# EAGLE design RaspiLabBoard (EAGLE 9.3.2)
RaspiLabBoard
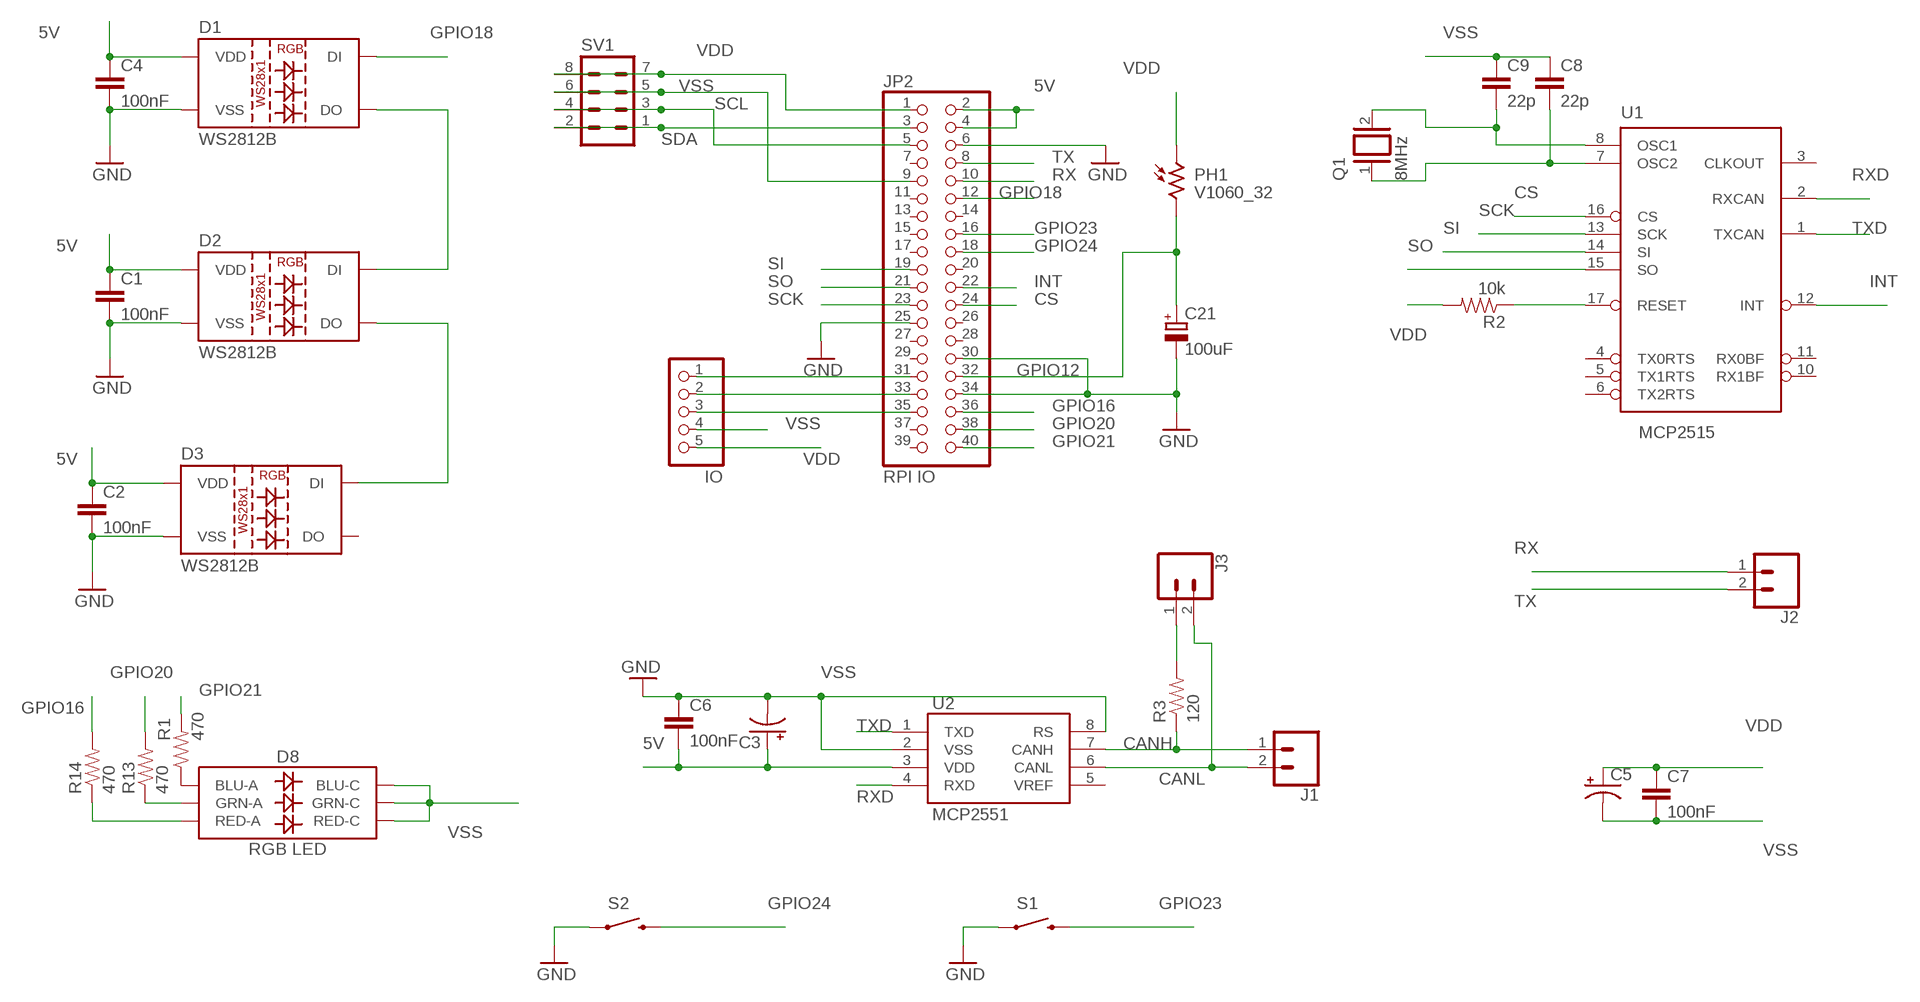
[diagram p0: schematic, sheet 1]

## Parts
C1  100nF  CAP0805  [0805]
C2  100nF  CAP0805  [0805]
C3  CPOL-USE2-5  [E2-5]
C4  100nF  CAP0805  [0805]
C5  CPOL-USE2-5  [E2-5]
C6  100nF  CAP0805  [0805]
C7  100nF  CAP0805  [0805]
C8  22p  CAP0805  [0805]
C9  22p  CAP0805  [0805]
C21  100uF  CPOL-EUE5-10.5  [E5-10,5]
D1  WS2812B  [WS2812B]
D2  WS2812B  [WS2812B]
D3  WS2812B  [WS2812B]
D8  RGB LED  LED-RGBNO_IC  [LED-TRICOLOR-5050]
J1  CONN_02  [1X02]
J2  CONN_02  [1X02]
J3  CONN_02  [1X02]
JP2  RPI IO  PINHD-2X20  [2X20]
JP4  IO  PINHD-1X5  [1X05]
PH1  V1060_32  [TO-5_V10]
Q1  8MHz  XTAL/S  [QS]
R1  470  RESISTOR0805-RES  [0805]
R2  10k  RESISTOR0805-RES  [0805]
R3  120  RESISTOR0805-RES  [0805]
R13  470  RESISTOR0805-RES  [0805]
R14  470  RESISTOR0805-RES  [0805]
S1  RESET  SWITCH-MOMENTARY-2SMD-1101NE  [TACTILE-SWITCH-1101NE]
S2  RESET  SWITCH-MOMENTARY-2SMD-1101NE  [TACTILE-SWITCH-1101NE]
SV1  MA04-2  [MA04-2]
U1  MCP2515  MCP2515(MCP2510)SO  [SO18W]
U2  MCP2551  [SO08]

## Nets
5V: C1.1 C2.1 C3.+ C4.1 C6.2 D1.1(VDD) D2.1(VDD) D3.1(VDD) JP2.2 JP2.4 U2.3(VDD)
CANH: J1.1 R3.1 U2.7(CANH)
CANL: J1.2 J3.2 U2.6(CANL)
CS: JP2.24 U1.16(CS)
GPIO6: JP2.31 JP4.1
GPIO12: C21.+ JP2.32 PH1.2
GPIO13: JP2.33 JP4.2
GPIO16: JP2.36 R14.2
GPIO18: D1.4(DI) JP2.12
GPIO19: JP2.35 JP4.3
GPIO20: JP2.38 R13.2
GPIO21: JP2.40 R1.2
GPIO23: JP2.16 S1.2
GPIO24: JP2.18 S2.2
INT: JP2.22 U1.12(INT)
N$1: D2.2(DO) D3.4(DI)
N$2: D8.1(GRN-A) R13.1
N$3: D8.3(BLU-A) R1.1
N$4: R2.1 U1.17(RESET)
N$7: C9.2 Q1.2 U1.8(OSC1)
N$8: D8.2(RED-A) R14.1
N$9: C8.2 Q1.1 U1.7(OSC2)
N$10: J3.1 R3.2
N$15: D1.2(DO) D2.4(DI)
RX: J2.1 JP2.10
RXD: U1.2(RXCAN) U2.4(RXD)
SCK: JP2.23 U1.13(SCK)
SCL: JP2.5 SV1.3 SV1.4
SDA: JP2.3 SV1.1 SV1.2
SI: JP2.19 U1.14(SI)
SO: JP2.21 U1.15(SO)
TX: J2.2 JP2.8
TXD: U1.1(TXCAN) U2.1(TXD)
VDD: C5.+ C7.1 JP2.1 JP4.5 PH1.1 R2.2 SV1.7 SV1.8
VSS: C1.2 C2.2 C3.- C4.2 C5.- C6.1 C7.2 C8.1 C9.1 C21.- D1.3(VSS) D2.3(VSS) D3.3(VSS) D8.4(BLU-C) D8.5(RED-C) D8.6(GRN-C) JP2.6 JP2.9 JP2.25 JP2.30 JP2.34 JP4.4 S1.1 S2.1 SV1.5 SV1.6 U2.2(VSS) U2.8(RS) ; supply symbol labelled GND
Unconnected: D3.2(DO) JP2.7 JP2.11 JP2.13 JP2.14 JP2.15 JP2.17 JP2.20 JP2.26 JP2.27 JP2.28 JP2.29 JP2.37 JP2.39 U1.3(CLKOUT) U1.4(TX0RTS) U1.5(TX1RTS) U1.6(TX2RTS) U1.10(RX1BF) U1.11(RX0BF) U2.5(VREF)

## Power pins joined to a net without a drawn wire
VDD: U1.18(VDD)
VSS: U1.9(VSS)

## Library data of the parts
C1 C2 C4 C6-C9 = SparkFun-Passives:CAP: Capacitor Standard 0603 ceramic capacitor, and 0.1" leaded capacitor.
C3 C5 = rcl:CPOL-US: POLARIZED CAPACITOR, American symbol; SPICEPREFIX: C
C21 = rcl:CPOL-EU: POLARIZED CAPACITOR, European symbol; SPICEPREFIX: C
D1-D3 = SparkFun-LED:WS2812B: WS2812B SMD addressable RGB LED 5x5mm SMD LED with built-in controller IC. Color: Red/Green/Blue mC Rating: RGB: 390, 660, 180 mcd Forward Voltage: RGB: 2.0, 3.0, 3.0 V Packages:WS2812B SparkFun Products: Blynk Board - ESP8266 <https://www.sparkfun.com/products/13794>; PROD_ID: DIO-12503
D8 = SparkFun-LED:LED-RGB: LED-RGB 6 pin RGB LED (no common connector) Packages: PLCC-6 LED-TRICOLOR-5050 - No built-in IC SparkFun Products: Digital Sandbox <https://www.sparkfun.com/products/12651> LED- SMD RGB <https://www.sparkfun.com/products/10866>; PROD_ID: DIO-10298
J1-J3 = SparkFun-Connectors:CONN_02: Multi connection point. Often used as Generic Header-pin footprint for 0.1 inch spaced/style header connections On any of the 0.1 inch spaced packages, you can populate with these: Break Away Headers - Straight <https://www.sparkfun.com/products/116> (PRT-00116) Break Away Male Headers - Right Angle <https://www.sparkfun.com/products/553> (PRT-00553) Female Headers <https://www.sparkfun.com/products/115> (PRT-00115) Break Away Headers - Machine Pin <https://www.sparkfun.com/products/117> (PRT-00117) Break Away Female Headers - Swiss Machine Pin <https://www.sparkfun.com/products/743> (PRT-00743) For SCREWTERMINALS and SPRING TERMINALS visit here: Screw Terimnals on SparkFun.com <https://www.sparkfun.com/search/results?term=Screw+Terminals> (5mm/3.5mm/2.54mm spacing) This device is also useful as a general connection point to wire up your design to another part of your project. Our various solder wires solder well into these plated through hole pads. Hook-Up Wire - Assortment (Stranded, 22 AWG) <https://www.sparkfun.com/products/11375> (PRT-11375) Hook-Up Wire - Assortment (Solid Core, 22 AWG) <https://www.sparkfun.com/products/11367> (PRT-11367) View the entire wire category on our website here <https://www.sparkfun.com/categories/141> Special notes: Molex polarized connector foot print use with: PRT-08233 with associated crimp pins and housings. 2.54_SCREWTERM for use with PRT-10571. 3.5mm Screw Terminal footprints for PRT-08084 5mm Screw Terminal footprints for use with PRT-08432
JP2 = pinhead:PINHD-2X20: PIN HEADER
JP4 = pinhead:PINHD-1X5: PIN HEADER
PH1 = photo-elements:?1060*: Sensor Street Light control Source: http://optoelectronics.perkinelmer.com/content/Datasheets/DTS_PhotocellsB1060.pdf
Q1 = special:XTAL/S: CRYSTAL
R1-R3 R13 R14 = SparkFun-Resistors:RESISTOR: Resistor Basic schematic elements and footprints for 0603, 1206, and PTH resistors.
S1 S2 = SparkFun-Electromechanical:SWITCH-MOMENTARY-2: Various NO switches- pushbuttons, reed, etc; PROD_ID: SWCH-00815
SV1 = con-lstb:MA04-2: PIN HEADER; OC_FARNELL: unknown; OC_NEWARK: unknown
U1 = SparkFun-IC-Comms:MCP2515(MCP2510): CAN controller with SPI interface The MCP2515 controller supercedes the MCP2510 while addressing all errata associated with it. The two devices are pin compatible, either can be used with this device. 18-pin package SOIC Simple SPI interface to any MCU. One-shot mode ensures message transmission is attempted only once Databyte filtering Start-of-Frame (SOF) output Low-power CMOS Technology Datasheet <http://www.sparkfun.com/datasheets/DevTools/Arduino/MCP2515.pdf> SparkFun Products CAN-BUS Shield <https://www.sparkfun.com/products/13262> (DEV-13262); PROD_ID: IC-09906; SPICEPREFIX: X
U2 = SparkFun-IC-Comms:MCP2551: MCP2551 High Speed CAN Transceiver High speed CAN transceiver Datasheet <http://www.sparkfun.com/datasheets/DevTools/Arduino/MCP2551.pdf> SparkFun Products CAN-BUS Shield <https://www.sparkfun.com/products/13262> (DEV-13262) SparkFun OBD-II UART <https://www.sparkfun.com/products/9555> (WIG-09555); PROD_ID: IC-09907

## Board
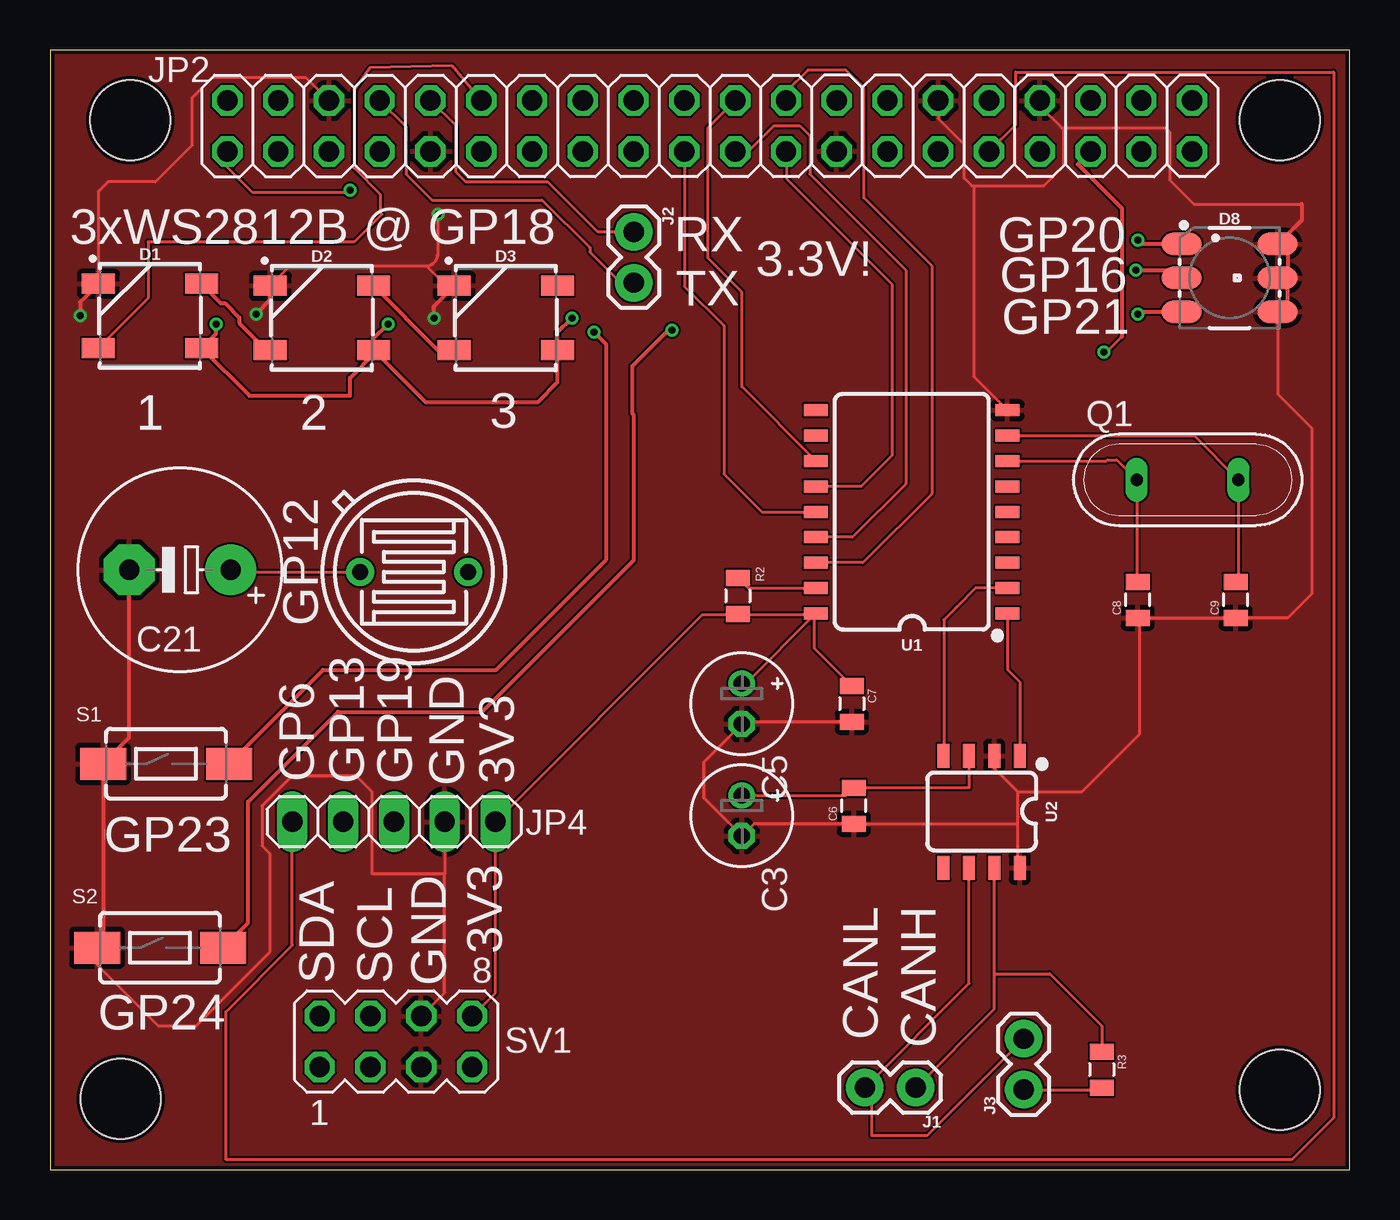
[diagram p1: board, top side]
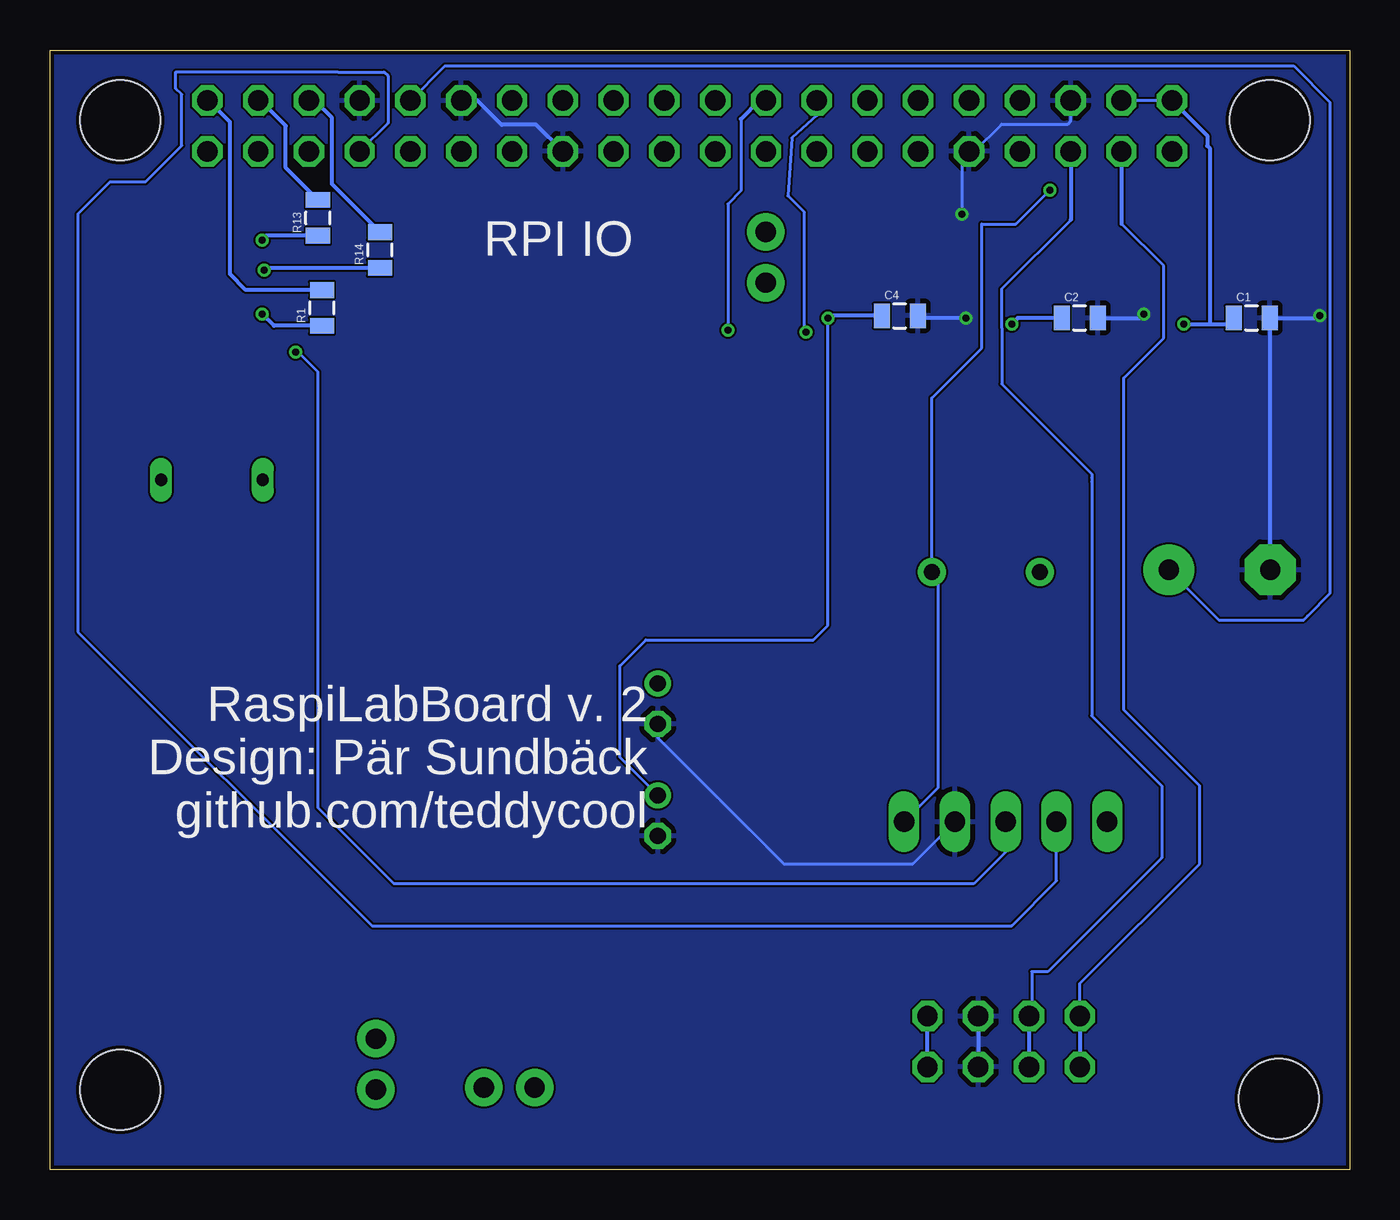
[diagram p2: board, bottom side, seen from below]

Size 65 x 56 mm. Coordinates in mm from the lower left corner, seen from the top.
Outline: 0,0 65,0 65,56 0,56 0,0
Copper layers (1*16): Top 0.035mm / dielectric 1.5mm / Bottom 0.035mm
Design rules "aisler_2_layer": minimum track width 0.1mm, minimum drill 0.2mm, track to track 0.1mm, track to pad 0.1mm, pad to pad 0.1mm, via to via 0.1mm, smd to smd 0.1mm, copper to edge 0.2mm, drill to drill 0.21mm, minimum pad ring 0.25mm, minimum via ring 0.15mm, stop-mask expansion 0mil, vias tented up to drill 0mil, thermal gap 10mil
Holes 4 mm at 3.54,3.54 61.5,4 4,52.5 61.5,52.5

### Footprints (pad centres in the part's own frame; a part is rotated, then mirrored left to right if it is on the bottom)
0805 = smd 0.8 x 1.2: 1 -0.9,0; 2 0.9,0
E2-5 = drill 0.813 pad 1.27: + -1.016,0 | drill 0.813 pad 1.27 octagon: - 1.016,0
E5-10,5 = drill 1.016 pad 2.54: + -2.54,0 | drill 1.016 pad 2.54 octagon: - 2.54,0
WS2812B = smd 1.651 x 1: 1 2.577,-1.6; 2 2.577,1.6; 3 -2.577,1.6; 4 -2.577,-1.6
LED-TRICOLOR-5050 = smd 2 x 1.1: 1 -2.4,1.7; 2 -2.4,0; 3 -2.4,-1.7; 4 2.4,-1.7; 5 2.4,0; 6 2.4,1.7
1X02 = drill 1.016 pad 1.88: 1 0,0; 2 2.54,0
2X20 = drill 1.016 octagon: 1 -24.13,-1.27; 2 -24.13,1.27; 3 -21.59,-1.27; 4 -21.59,1.27; 5 -19.05,-1.27; 6 -19.05,1.27; 7 -16.51,-1.27; 8 -16.51,1.27; 9 -13.97,-1.27; 10 -13.97,1.27; 11 -11.43,-1.27; 12 -11.43,1.27; 13 -8.89,-1.27; 14 -8.89,1.27; 15 -6.35,-1.27; 16 -6.35,1.27; 17 -3.81,-1.27; 18 -3.81,1.27; 19 -1.27,-1.27; 20 -1.27,1.27; 21 1.27,-1.27; 22 1.27,1.27; 23 3.81,-1.27; 24 3.81,1.27; 25 6.35,-1.27; 26 6.35,1.27; 27 8.89,-1.27; 28 8.89,1.27; 29 11.43,-1.27; 30 11.43,1.27; 31 13.97,-1.27; 32 13.97,1.27; 33 16.51,-1.27; 34 16.51,1.27; 35 19.05,-1.27; 36 19.05,1.27; 37 21.59,-1.27; 38 21.59,1.27; 39 24.13,-1.27; 40 24.13,1.27
1X05 = drill 1.016 long: 1 -5.08,0; 2 -2.54,0; 3 0,0; 4 2.54,0; 5 5.08,0
TO-5_V10 = drill 0.8 pad 1.4: 1 -2.7,0; 2 2.7,0
QS = drill 0.61 long: 1 -2.54,0; 2 2.54,0
TACTILE-SWITCH-1101NE = smd 2.3 x 1.6: 1 -3.15,0; 2 3.15,0
MA04-2 = drill 1.016 octagon: 1 -3.81,-1.27; 2 -3.81,1.27; 3 -1.27,-1.27; 4 -1.27,1.27; 5 1.27,-1.27; 6 1.27,1.27; 7 3.81,-1.27; 8 3.81,1.27
SO18W = smd 0.6 x 1.2: 1 -5.08,-4.788; 2 -3.81,-4.788; 3 -2.54,-4.788; 4 -1.27,-4.788; 5 0,-4.788; 6 1.27,-4.788; 7 2.54,-4.788; 8 3.81,-4.788; 9 5.08,-4.788; 10 5.08,4.788; 11 3.81,4.788; 12 2.54,4.788; 13 1.27,4.788; 14 0,4.788; 15 -1.27,4.788; 16 -2.54,4.788; 17 -3.81,4.788; 18 -5.08,4.788
SO08 = smd 0.6 x 1.2: 1 -1.905,-2.8; 2 -0.635,-2.8; 3 0.635,-2.8; 4 1.905,-2.8; 5 1.905,2.8; 6 0.635,2.8; 7 -0.635,2.8; 8 -1.905,2.8

### Placement (x,y rotation side)
C1  4.9,42.6 0 bottom
C2  13.5,42.6 0 bottom
C3  34.6,17.7 270 top
C4  22.5,42.7 0 bottom
C5  34.6,23.3 270 top
C6  40.2,18.2 90 top
C7  40.1,23.3 270 top
C8  54.4,28.5 90 top
C9  59.3,28.5 90 top
C21  6.5,30 180 top
D1  5,42.7 0 top
D2  13.6,42.6 0 top
D3  22.8,42.6 0 top
D8  59,44.6 0 top
J1  43.3,4.1 180 top
J2  29.2,46.9 270 top
J3  48.7,4 90 top
JP2  33,52.2 0 top
JP4  17.2,17.4 0 top
PH1  18.2,29.9 180 top
Q1  56.9,34.5 0 top
R1  51.4,43.1 90 bottom
R2  34.4,28.7 270 top
R3  52.6,5 270 top
R13  51.6,47.6 90 bottom
R14  48.5,46 90 bottom
S1  5.8,20.3 0 top
S2  5.5,11.1 0 top
SV1  17.3,6.4 0 top
U1  43.1,32.9 90 top
U2  46.6,17.9 180 top

### Tracks (layer width: path | path; a pad name or v marks a point on that pad's centre or on a via)
5V  (via drill 0.35)
  Top 0.152: U2.3 45.97,19.1 C6.2 39.82,18.72 C3.+
  Top 0.2: 16.29,40.89 D2.1 16.18,41.58 v16.9,42.3 | 16.29,40.89 18.78,38.4 24.4,38.4 25.38,39.38 D3.1 25.38,41.88 v26.1,42.6 | 16.29,40.89 15,39.6 15,38.7 9.98,38.7 D1.1 8.3,41.82 v8.3,42.3
  Bottom 0.152: JP2.2 JP2.4 | v26.1,42.6 26.1,27.22 26.82,26.5 35.2,26.5 36.5,25.2 36.5,20.62 C3.+
  Bottom 0.2: C2.1 16.6,42.6 v16.9,42.3 | C4.1 26,42.7 v26.1,42.6 | v8.3,42.3 7,42.3 | 7,42.3 6.1,42.3 C1.1 | JP2.2 7.12,51.72 7.12,51.21 7,51.09 7,42.3
CANH
  Top 0.152: J1.1 47.23,8.04 47.23,9.8 | 47.23,9.8 U2.7 | 47.23,9.8 50,9.8 52.6,7.2 R3.1
CANL
  Top 0.152: U2.6 45.97,9.3 J1.2 41.1,3.76 41.1,1.7 43.86,1.7 J3.2
CS
  Top 0.152: U1.16 40.66,30.36 44.1,33.8 44.1,45.2 40.7,48.6 40.7,54.1 39.8,55 37.9,55 36.81,53.91 JP2.24
GPIO6
  Top 0.152: JP2.31 48.3,52.26 48.3,54.9 64.2,54.9 64.2,2.6 62.1,0.5 8.8,0.5 8.8,7.9 12.12,11.22 JP4.1
GPIO12
  Top 0.152: C21.+ 9.14,29.9 PH1.2
  Bottom 0.152: JP2.32 45.24,55.2 2.8,55.2 1,53.4 1,28.8 2.1,27.7 2.3,27.5 6.54,27.5 C21.+
GPIO13
  Bottom 0.152: JP2.33 48.1,52.34 48.1,54.7 48.3,54.9 50.6,54.9 50.61,54.91 58.7,54.91 58.7,54.07 58.41,53.78 58.41,51.22 60.22,49.41 61.99,49.41 63.6,47.8 63.6,26.9 48.9,12.2 16.9,12.2 14.66,14.44 JP4.2
GPIO16
  Bottom 0.2: R14.2 50.9,49.3 50.9,52.6 51.77,53.47 JP2.36
GPIO18
  Top 0.152: JP2.12 20.1,55.2 16,55.1 15.2,54 15.2,50.1 16.5,48.8 16.5,47.9 16.6,47.8 15.2,46.4 4.9,46.4 4.9,43.58 D1.4
GPIO19  (via drill 0.35)
  Top 0.152: 53.6,41.65 52.85,40.9 v52.7,40.9
  Top 0.2: JP2.35 51.4,50.28 53.6,48.08 53.6,41.65
  Bottom 0.152: JP4.3 17.2,15.9 18.8,14.3 47.8,14.3 51.6,18.1 51.6,39.9 52.6,40.9 v52.7,40.9
GPIO20
  Bottom 0.2: R13.2 53.2,50.1 53.2,52.2 54.47,53.47 JP2.38
GPIO21
  Bottom 0.2: R1.2 55.2,44 56,44.8 56,52.4 57.07,53.47 JP2.40
GPIO23  (via drill 0.35)
  Top 0.2: S1.2 13.65,25 22.3,25 27.8,30.5 27.8,41.3 v27.2,41.9
  Bottom 0.152: 26.65,52.75 27.9,51.6 28.09,48.71 27.3,47.91 27.3,42 v27.2,41.9
  Bottom 0.2: JP2.16 26.65,52.75
GPIO24  (via drill 0.35)
  Top 0.2: S2.2 9.9,12.35 9.9,18.4 14.4,22.9 21.6,22.9 29.2,30.5 29.2,37.75 29.13,37.81 29.13,40.19 30.81,41.87 30.97,41.87 v31.1,42
  Bottom 0.152: 30.45,52.55 30.45,48.95 31.1,48.3 v31.1,42
  Bottom 0.2: 30.45,52.55 29.53,53.47 JP2.18
INT
  Top 0.152: U1.12 34.6,39.15 34.6,43.9 32.9,45.6 32.9,52.1 JP2.22
N$1
  Top 0.2: D2.2 19.38,41 D3.4
N$2  (via drill 0.35)
  Top 0.2: D8.1 54.6,46.3 v54.4,46.5
  Bottom 0.2: R13.1 54.2,46.7 v54.4,46.5
N$3  (via drill 0.35)
  Top 0.2: D8.3 54.5,42.9 v54.4,42.8
  Bottom 0.2: R1.1 53.8,42.2 v54.4,42.8
N$4
  Top 0.152: R2.1 34.91,29.09 U1.17
N$7
  Top 0.152: U1.8 57.23,36.71 Q1.2 59.44,29.54 C9.2
N$8  (via drill 0.35)
  Top 0.2: v54.3,45 56.2,45 D8.2
  Bottom 0.2: R14.1 54.2,45.1 v54.3,45
N$9
  Top 0.152: U1.7 52.84,35.44 52.9,35.5 53.36,35.5 Q1.1 54.36,29.44 C8.2
N$10
  Top 0.152: J3.1 52.5,4 R3.2
N$15
  Top 0.2: D1.2 8.55,43.33 8.76,43.33 9.47,42.62 9.47,42.34 10.81,41 D2.4
RX
  Top 0.152: J2.1 27.4,46.9 24.9,49.4 20.8,49.4 20.3,49.9 20.3,52.2 JP2.10
RXD
  Top 0.152: U1.2 46.29,29.09 45.35,28.15 45.3,28.1 44.7,27.5 U2.4
SCK
  Top 0.152: U1.13 40.57,34.17 42.1,35.7 42.1,44.3 36.85,49.55 36.85,50.89 JP2.23
SCL
  Bottom 0.152: 16.03,7.5 15.9,7.63 15.9,9.9 15.1,9.9 9.4,15.6 9.4,19.2 12.9,22.7 12.9,34.4 12.9,34.6 12.9,34.8 17.4,39.3 17.4,42.09 17.4,44.05 13.95,47.5
  Bottom 0.2: JP2.5 13.95,47.5 | SV1.4 16.03,7.5 SV1.3
SDA
  Bottom 0.152: SV1.2 13.49,9.31 7.5,15.3 7.5,19.2 11.3,23 11.3,39.6 9.3,41.6 9.3,45.2 11.4,47.3
  Bottom 0.2: 11.4,47.3 JP2.3 | SV1.2 SV1.1
SI
  Top 0.152: JP2.19 31.73,44.17 33.7,42.2 33.7,34.8 35.6,32.9 U1.14
SO
  Top 0.152: JP2.21 34.93,50.93 36.2,52.2 37.5,52.2 38,51.7 38,49.8 38.05,49.75 42.8,45 42.8,34.3 40.13,31.63 U1.15
TX
  Top 0.152: JP2.8 17.8,52.16 17.8,49.8 19.1,48.5 24.6,48.5 27,46.1 27,45.9 28.54,44.36 J2.2
TXD
  Top 0.152: U1.1 47.89,25.01 48.51,24.39 U2.1
VDD  (via drill 0.35)
  Top 0.152: SV1.8 22.28,8.84 JP4.5 32.63,27.75 34.45,27.75 | U1.18 38.25,27.75 | 38.25,27.75 34.81,24.32 C5.+ | C7.1 38.25,26.05 38.25,27.75 | R2.2 34.45,27.75 | 34.45,27.75 38.25,27.75 | JP2.1 8.87,50.13 10.1,48.9 14.9,48.9 v15,49
  Bottom 0.152: JP4.5 20.6,19.08 20.6,29.9 PH1.1 20.9,38.6 18.4,41.1 18.4,47.3 16.7,47.3 v15,49
  Bottom 0.2: SV1.7 SV1.8
VSS  (via drill 0.35)
  Top 0.152: JP2.34 49.51,53.19 50.6,52.1 50.7,52.1 | 50.7,52.1 55.8,52.1 56,51.9 56,49.5 57.2,48.3 62.6,48.3 | JP4.4 19.74,14.8 | JP2.6 12.82,54.6 8.1,54.6 7.09,53.59 7.09,51.22 5.28,49.41 2.91,49.41 2.42,48.92 D1.3 | D2.3 12.02,45.2 18.8,45.2 | 18.8,45.2 20.01,43.99 | S2.1 2.35,10.25 5.4,7.2 7.3,7.2 11,10.9 11,15.8 10.6,16.2 10.6,18.2 12.1,19.7 15.3,19.7 16.1,18.9 16.1,14.8 19.74,14.8 | JP2.30 44.43,52.57 45.7,51.3 45.7,49.6 46.1,49.2 46.2,49.2 | 50.7,52.1 50.7,50.2 49.7,49.2 46.2,49.2 | 18.8,45.2 arc90 19.4,45.8 v19.4,47.8 | C8.1 54.5,27.6 | 54.5,27.6 C9.1 61.9,27.6 63.1,28.8 63.1,37.1 61.4,38.8 D8.4 | C7.2 34.72,22.4 C5.- 32.7,20.38 32.7,18.58 C3.- 35.22,17.3 C6.1 48.4,17.3 | SV1.6 19.74,8.84 19.74,14.8 | 46.2,49.2 46.2,39.67 U1.9 | U2.2 47.23,20.07 48.4,18.9 | 48.4,18.9 51.6,18.9 54.5,21.8 54.5,27.6 | U2.8 48.4,15.21 48.4,17.3 | 48.4,17.3 48.4,18.9
  Top 0.2: 62.6,48.3 62.6,47.5 D8.6 61.9,45.8 61.9,44.4 | 61.9,44.4 61.6,44.4 D8.5 | D8.4 61.9,43.4 61.9,44.4 | D1.3 1.5,43.38 v1.5,42.7 | v10.3,42.8 11.02,43.52 D2.3 | v19.2,42.6 19.2,43.18 20.01,43.99 D3.3 | S2.1 2.65,11.4 S1.1 3.96,21.61 C21.-
  Bottom 0.152: v19.4,47.8 19.4,50.56 arc90 JP2.9 18.77,50.93 17.4,52.3 14.1,52.3 13.95,52.45 JP2.6 | C5.- 34.6,21.6 28.3,15.3 21.84,15.3 JP4.4
  Bottom 0.2: C2.2 10.5,42.6 v10.3,42.8 | v19.2,42.6 21.5,42.6 C4.2 | v1.5,42.7 1.6,42.6 C1.2 4,30.04 C21.- | JP2.25 40.68,52.26 42.41,52.26 43.62,53.47 JP2.30 | SV1.6 SV1.5
  pour Bottom: 65.5,56.5 65.4,-0.8 -1.3,-0.7 -1.3,57.1
  pour Top: 65.8,57 66,-0.8 -1.1,-0.6 -0.6,56.8

### Text on the board
tNames: RX | 3xWS2812B @ GP18 | GP20 | TX | 3.3V! | GP16 | GP21 | 1 | 2 | 3 | GP12 | GP6 | GP13 | GP19 | GND | 3V3 | GP23 | 3V3 | SDA | SCL | GND | GP24 | CANL | CANH
bNames: RPI IO | RaspiLabBoard v. 2 / Design: Pär Sundbäck / github.com/teddycool